# EAGLE design covox (EAGLE 9.5.2)
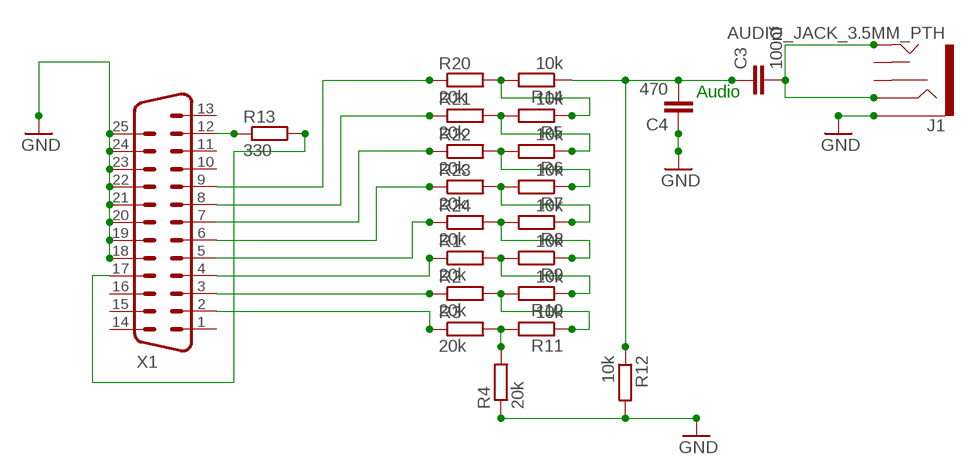
[diagram p0: schematic, sheet 1]

## Parts
C3  100nf  C-EUC0805K  [C0805K]
C4  470  C-EUC0805K  [C0805K]
J1  AUDIO_JACK_3.5MM_PTH  [AUDIO-JACK]
R1  20k  R-EU_M0805  [M0805]
R2  20k  R-EU_M0805  [M0805]
R3  20k  R-EU_M0805  [M0805]
R4  20k  R-EU_M0805  [M0805]
R5  10k  R-EU_M0805  [M0805]
R6  10k  R-EU_M0805  [M0805]
R7  10k  R-EU_M0805  [M0805]
R8  10k  R-EU_M0805  [M0805]
R9  10k  R-EU_M0805  [M0805]
R10  10k  R-EU_M0805  [M0805]
R11  10k  R-EU_M0805  [M0805]
R12  10k  R-EU_M0805  [M0805]
R13  330  R-EU_M0805  [M0805]
R14  10k  R-EU_M0805  [M0805]
R20  20k  R-EU_M0805  [M0805]
R21  20k  R-EU_M0805  [M0805]
R22  20k  R-EU_M0805  [M0805]
R23  20k  R-EU_M0805  [M0805]
R24  20k  R-EU_M0805  [M0805]
X1  M25HP  [M25HP]

## Nets
D0: R3.1 X1.2
D1: R2.1 X1.3
D2: R1.1 X1.4
D3: R24.1 X1.5
D4: R23.1 X1.6
D5: R22.1 X1.7
D6: R21.1 X1.8
D7: R20.1 X1.9
GND: C4.1 J1.SLEEVE R4.1 R12.2 X1.18 X1.19 X1.20 X1.21 X1.22 X1.23 X1.24 X1.25
N$1: R3.2 R4.2 R11.2
N$2: R2.2 R10.2 R11.1
N$3: R1.2 R9.2 R10.1
N$4: R7.2 R8.1 R23.2
N$5: C3.2 J1.RING J1.TIP
N$6: R6.2 R7.1 R22.2
N$7: R5.2 R6.1 R21.2
N$8: R5.1 R14.2 R20.2
N$11: C3.1 C4.2 R12.1 R14.1
N$17: R8.2 R9.1 R24.2
N$19: R13.2 X1.17
N$20: R13.1 X1.12
Unconnected: J1.RSH J1.TSH X1.1 X1.10 X1.11 X1.13 X1.14 X1.15 X1.16

## Notes on the sheet
- Audio

## Library data of the parts
C3 C4 = rcl:C-EU: CAPACITOR, European symbol; SPICEPREFIX: C
J1 = SparkFun-Connectors:AUDIO_JACK_3.5MM: Audio Jack 3.5mm variants of PTH and SMT stereo audio jack with bypass switches. SparkFun Products: SparkFun SparkPunk Sound Kit <[https://www.sparkfun.com/products/11177]> - PTH MP3 Trigger <https://www.sparkfun.com/products/13720> -3.5mm SMD SparkFun PicoBoard <https://www.sparkfun.com/products/11888>- 2.5mm SMD; PROD_ID: CONN-08774; SF_ID: PRT-08032
R1-R14 R20-R24 = rcl:R-EU_: RESISTOR, European symbol; SPICEPREFIX: R
X1 = con-subd:M25: SUB-D; OC_FARNELL: unknown; OC_NEWARK: unknown

## Board
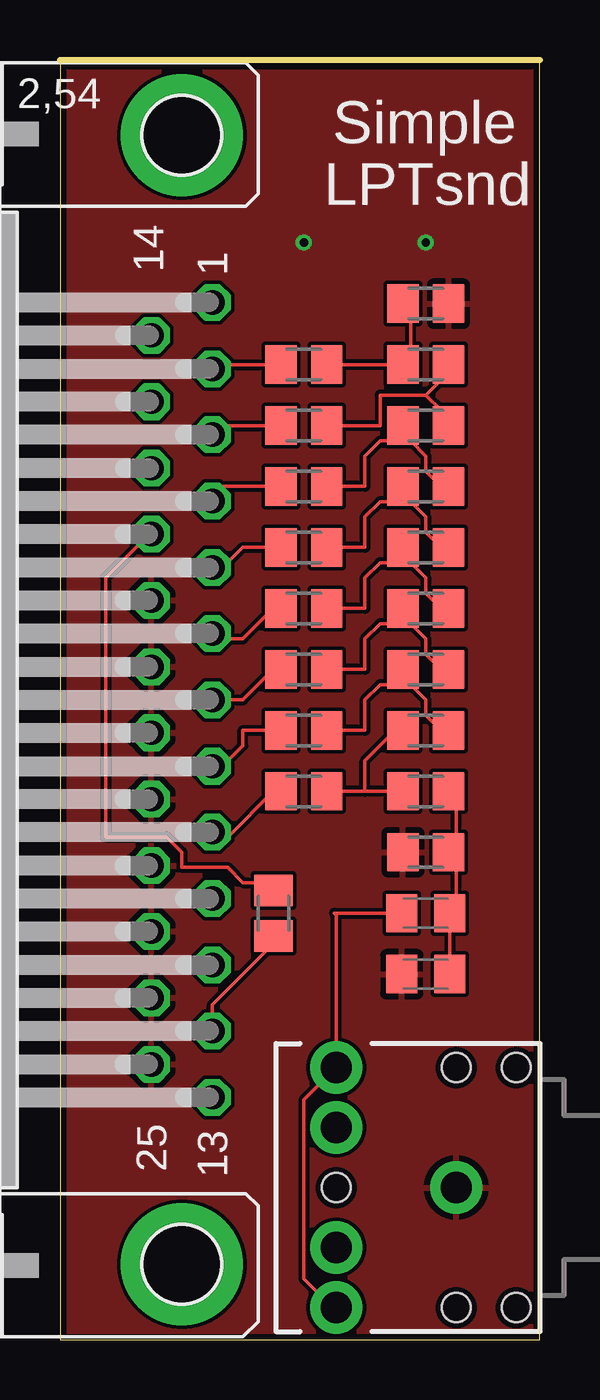
[diagram p1: board, top side]
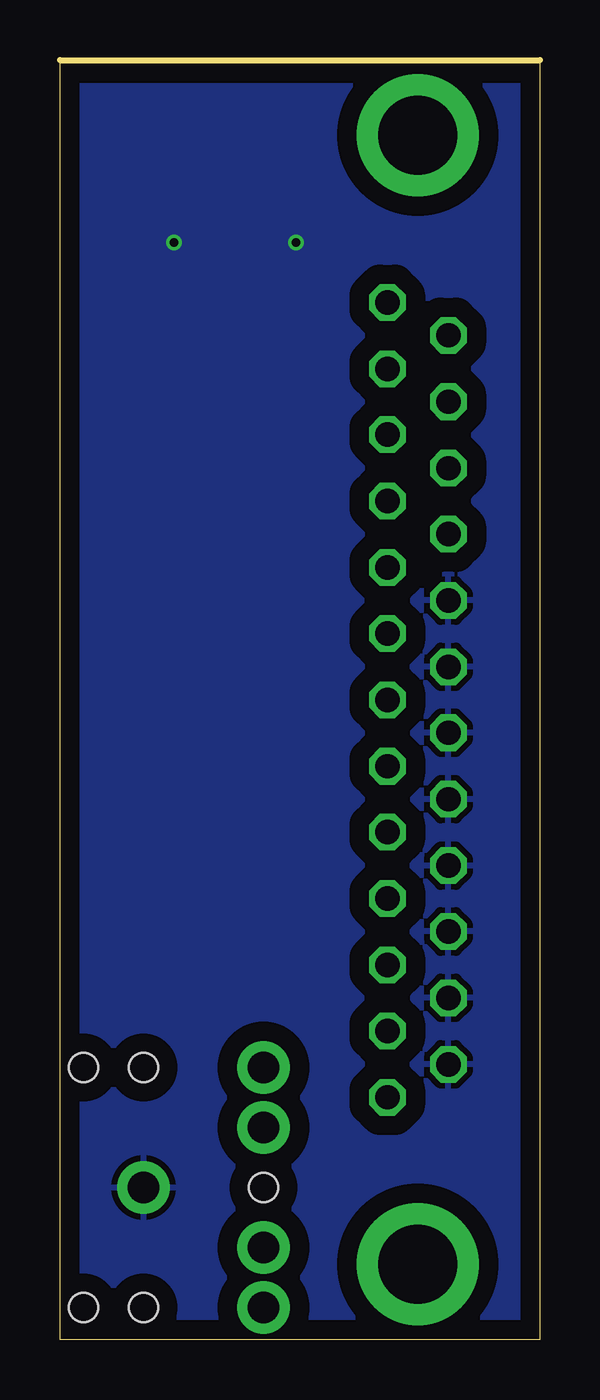
[diagram p2: board, bottom side, seen from below]

Size 19.99 x 53.33 mm. Coordinates in mm from the lower left corner, seen from the top.
Outline: 0,0 19.99,0 19.99,53.33 0,53.33 0,0
Copper layers (1*16): Top 0.035mm / dielectric 1.5mm / Bottom 0.035mm
Design rules "dirt_cheap_dirty_boards.v1.1": minimum track width 6mil, minimum drill 12mil, track to track 6mil, track to pad 6mil, pad to pad 6mil, via to via 6mil, smd to smd 0mil, copper to edge 10mil, drill to drill 10mil, minimum pad ring 10mil, minimum via ring 6mil, stop-mask expansion 2mil, vias tented up to drill 25mil, thermal gap 10mil

### Footprints (pad centres in the part's own frame; a part is rotated, then mirrored left to right if it is on the bottom)
C0805K = smd 1.3 x 1.6: 1 -1,0; 2 1,0
AUDIO-JACK = drill 1.3 pad 2.184: RING 5,5; RSH 5,2.5; SLEEVE 0,0; TIP 5,-5; TSH 5,-2.5 | hole 1.2: 0,5; -2.5,5; -2.5,-5; 0,-5; 5,0
M0805 = smd 1.3 x 1.6: 1 -0.95,0; 2 0.95,0
M25HP = drill 1.016 octagon: 1 -16.561,1.27; 2 -13.792,1.27; 3 -11.049,1.27; 4 -8.28,1.27; 5 -5.512,1.27; 6 -2.769,1.27; 7 0,1.27; 8 2.769,1.27; 9 5.512,1.27; 10 8.28,1.27; 11 11.049,1.27; 12 13.792,1.27; 13 16.561,1.27; 14 -15.189,-1.27; 15 -12.421,-1.27; 16 -9.652,-1.27; 17 -6.909,-1.27; 18 -4.14,-1.27; 19 -1.372,-1.27; 20 1.372,-1.27; 21 4.14,-1.27; 22 6.909,-1.27; 23 9.652,-1.27; 24 12.421,-1.27; 25 15.189,-1.27 | drill 3.302 pad 5.08: G1 -23.52,0; G2 23.52,0

### Placement (x,y rotation side)
C3  15.24,17.78 180 top
C4  15.24,15.24 0 top
J1  16.51,6.35 180 top
R1  10.16,35.56 0 top
R2  10.16,38.1 0 top
R3  10.16,40.64 0 top
R4  15.24,43.18 180 top
R5  15.24,25.4 0 top
R6  15.24,27.94 0 top
R7  15.24,30.48 0 top
R8  15.24,33.02 0 top
R9  15.24,35.56 0 top
R10  15.24,38.1 0 top
R11  15.24,40.64 180 top
R12  15.24,20.32 180 top
R13  8.89,17.78 90 top
R14  15.24,22.86 180 top
R20  10.16,22.86 0 top
R21  10.16,25.4 0 top
R22  10.16,27.94 0 top
R23  10.16,30.48 0 top
R24  10.16,33.02 0 top
X1  5.08,26.67 270 top

### Tracks (layer width: path | path; a pad name or v marks a point on that pad's centre or on a via)
D0
  Top 0.152: R3.1 6.35,40.64 X1.2
D1
  Top 0.152: R2.1 6.35,38.1 X1.3
D2
  Top 0.152: R1.1 6.35,35.56 X1.4
D3
  Top 0.152: R24.1 7.62,33.02 6.35,31.75 X1.5
D4
  Top 0.152: R23.1 8.89,30.48 7.62,29.21 6.35,29.21 X1.6
D5
  Top 0.152: X1.7 7.62,26.67 8.89,27.94 R22.1
D6
  Top 0.152: R21.1 7.62,25.4 7.62,24.76 6.35,23.5 X1.8
D7
  Top 0.152: R20.1 8.89,22.86 6.99,20.96 6.35,20.96 X1.9
GND  (via drill 0.35)
  other vias: 15.24,45.72 10.16,45.72
  pour Bottom (isolate 0.813): 0,53.34 0,0 22.86,0 22.86,53.34
  pour Top: 0,53.34 0,0 20.32,0 20.32,53.34
N$1
  Top 0.152: R3.2 R11.2 14.61,40.64 14.61,43.18 R4.2
N$2
  Top 0.152: R2.2 13.34,38.1 13.34,39.37 15.24,39.37 | 15.24,39.37 15.88,40 15.88,40.64 R11.1 | 15.24,39.37 15.88,38.73 15.88,38.1 R10.2
N$3
  Top 0.152: R1.2 12.7,35.56 12.7,36.83 13.34,37.47 13.97,37.47 13.97,38.1 R10.1 14.61,38.1 14.61,37.47 15.24,36.83 15.24,36.19 15.88,35.56 R9.2
N$4
  Top 0.152: R23.2 12.7,30.48 12.7,31.75 13.34,32.39 13.97,32.39 13.97,33.02 R8.1 14.61,33.02 14.61,32.39 15.24,31.75 15.24,31.11 15.88,30.48 R7.2
N$5
  Top 0.152: 13.97,17.78 C3.2 11.43,17.78 11.51,17.7 J1.TIP 10.16,10 10.16,2.54 11.35,1.35 J1.RING
N$6
  Top 0.152: R22.2 12.7,27.94 12.7,29.21 13.34,29.84 13.97,29.84 13.97,30.48 R7.1 14.61,30.48 14.61,29.84 15.24,29.21 15.24,28.57 15.88,27.94 R6.2
N$7
  Top 0.152: R21.2 12.7,25.4 12.7,26.67 13.34,27.3 13.97,27.3 13.97,27.94 R6.1 14.61,27.94 14.61,27.3 15.24,26.67 15.24,26.04 15.88,25.4 R5.2
N$8
  Top 0.152: R14.2 12.7,22.86 | 12.7,22.86 R20.2 | 12.7,22.86 12.7,24.13 13.97,25.4 R5.1
N$11
  Top 0.152: R14.1 16.51,22.86 16.51,20.32 | C4.2 C3.1 16.51,17.78 16.51,20.32 | R12.1 16.51,20.32
N$17
  Top 0.152: R24.2 12.7,33.02 12.7,34.29 13.34,34.92 13.97,34.92 13.97,35.56 R9.1 14.61,35.56 14.61,34.92 15.24,34.29 15.24,33.66 15.88,33.02 R8.2
N$19
  Top 0.152: R13.2 8.89,19.05 7.62,19.05 6.99,19.68 5.08,19.68 5.08,20.32 4.45,20.96 1.91,20.96 1.91,31.75 3.81,33.66 X1.17
N$20
  Top 0.152: X1.12 6.35,13.97 8.89,16.51 R13.1

### Text on the board
tNames: Simple | LPTsnd